# EAGLE design envelope_detection (EAGLE 9.5.1)
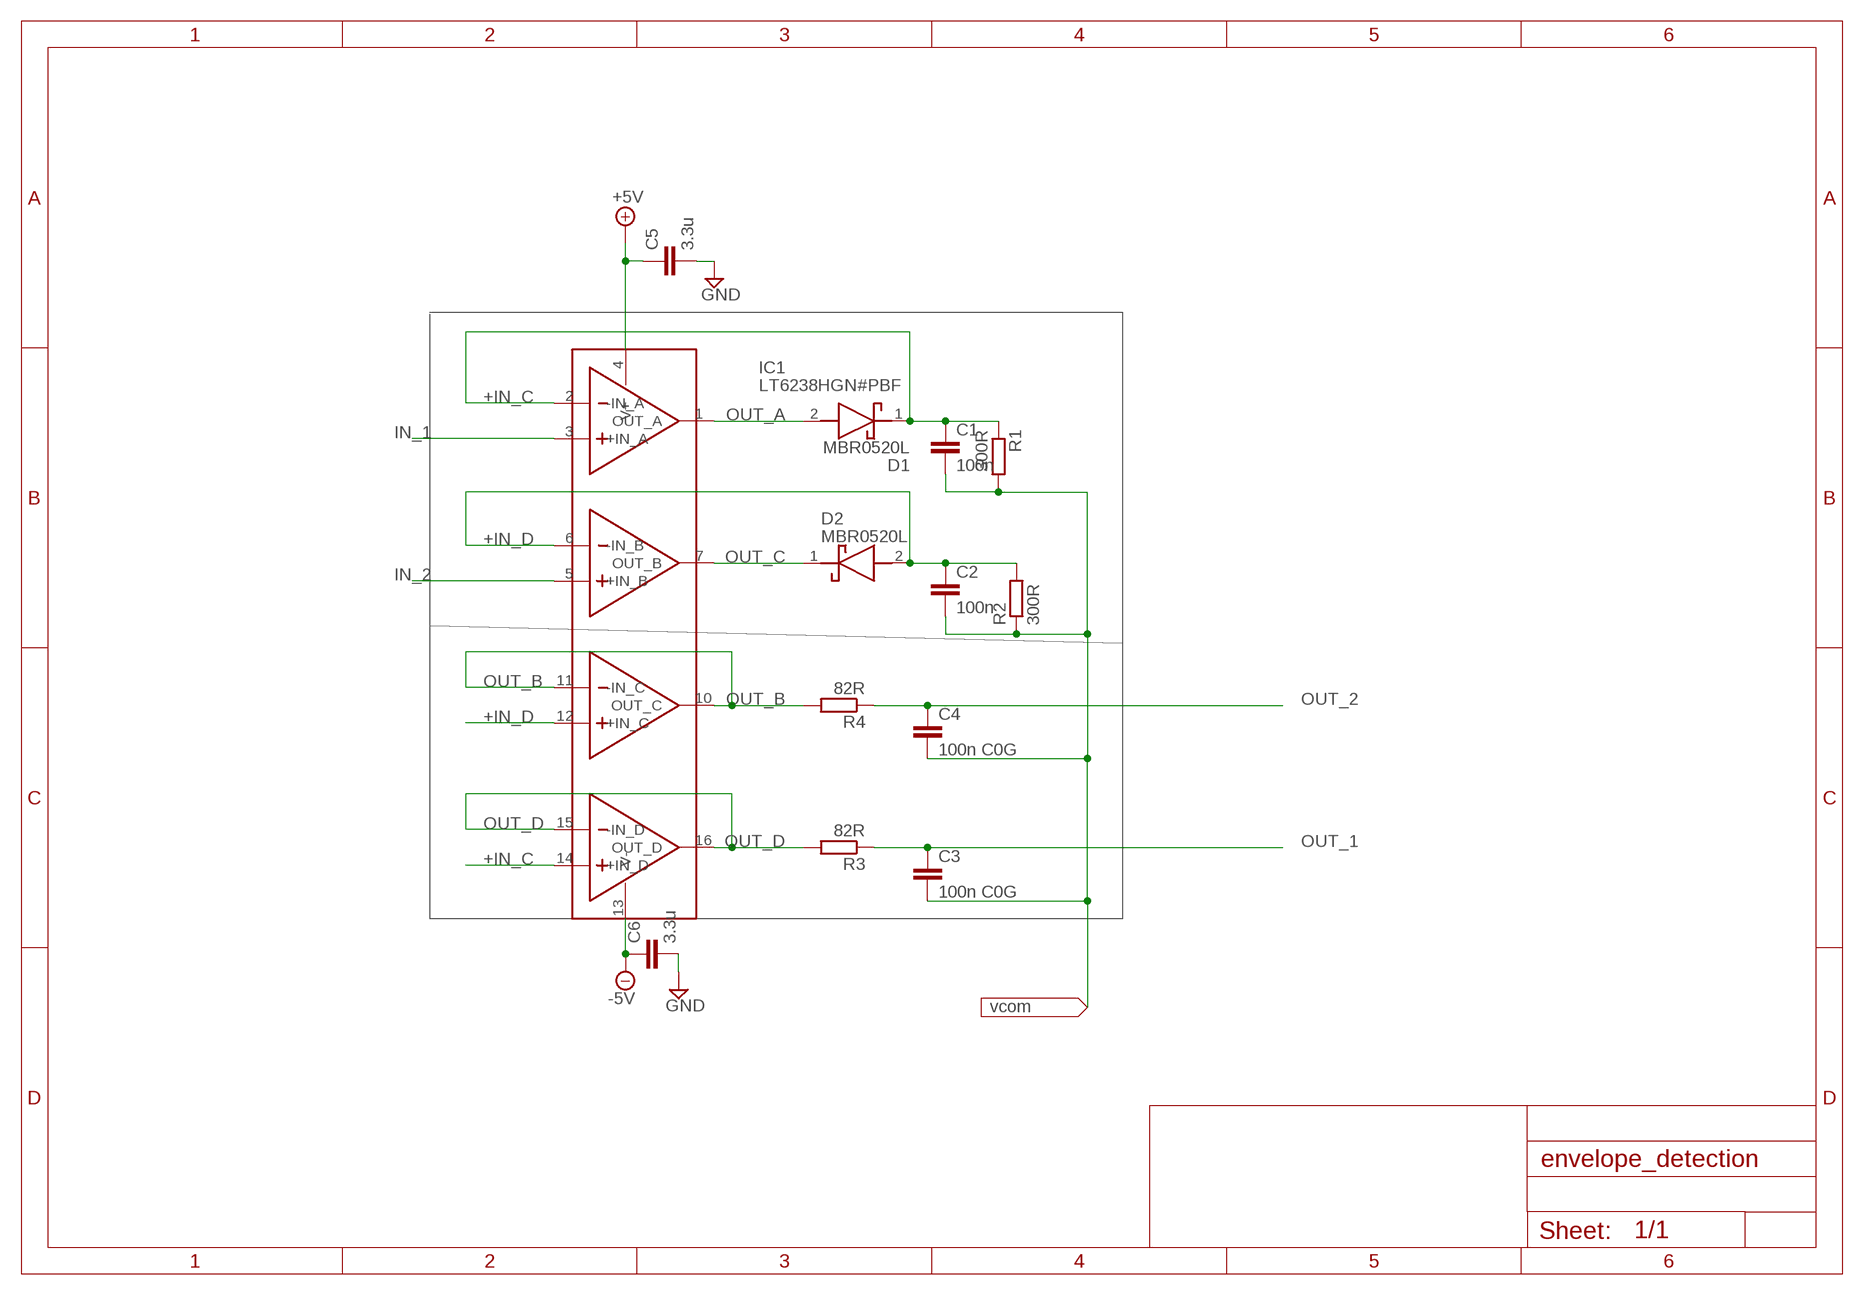
[diagram p0: schematic, sheet 1]

## Parts
C1  100n  C-EUC0603  [C0603]
C2  100n  C-EUC0603  [C0603]
C3  100n C0G  C-EUC1206  [C1206]
C4  100n C0G  C-EUC1206  [C1206]
C5  3.3u  C-EUC0402  [C0402]
C6  3.3u  C-EUC0402  [C0402]
D1  MBR0520L  [SOD3816X128N]
D2  MBR0520L  [SOD3816X128N]
IC1  LT6238HGN#PBF  [SOP64P601X175-16N]
R1  300R  R-EU_M0805  [M0805]
R2  300R  R-EU_M0805  [M0805]
R3  82R  R-EU_M0805  [M0805]
R4  82R  R-EU_M0805  [M0805]

## Nets
+5V: C5.1 IC1.4(V+)
+IN_C: C1.1 D1.1(K) IC1.2(-IN_A) IC1.14(+IN_D) R1.1
+IN_D: C2.1 D2.2(A) IC1.6(-IN_B) IC1.12(+IN_C) R2.2
-5V: C6.1 IC1.13(V-)
GND: C5.2 C6.2
IN_1: IC1.3(+IN_A)
IN_2: IC1.5(+IN_B)
OUT_1: C3.1 R3.1
OUT_2: C4.1 R4.1
OUT_A: D1.2(A) IC1.1(OUT_A)
OUT_B: IC1.10(OUT_C) IC1.11(-IN_C) R4.2
OUT_C: D2.1(K) IC1.7(OUT_B)
OUT_D: IC1.15(-IN_D) IC1.16(OUT_D) R3.2
VCOM: C1.2 C2.2 C3.2 C4.2 R1.2 R2.1

## Library data of the parts
C1-C6 = rcl:C-EU: CAPACITOR, European symbol; SPICEPREFIX: C
D1 D2 = wouter:MBR0520L: ON Semi MBR0520L SMT Schottky Diode, 20V 500mA, 2-Pin SOD-123 Source: Datasheet <https://www.onsemi.com/pub/Collateral/MBR0520L-D.pdf>; DESCRIPTION: ON Semi MBR0520L SMT Schottky Diode, 20V 500mA, 2-Pin SOD-123; HEIGHT: 1.28mm; MANUFACTURER_NAME: ON Semiconductor; MANUFACTURER_PART_NUMBER: MBR0520L; MOUSER_PART_NUMBER: 512-MBR0520L; MOUSER_PRICE-STOCK: https://www.mouser.com/Search/Refine.aspx?Keyword=512-MBR0520L; RS_PART_NUMBER: 7390521P; RS_PRICE-STOCK: http://uk.rs-online.com/web/p/products/7390521P
IC1 = wouter:LT6238HGN#PBF: Rail-to-Rail Output 215MHz, 1.1nV/Hz Op Amp/SAR ADC Driver Source: Datasheet <http://www.analog.com/media/en/technical-documentation/data-sheets/623637fb.pdf>; DESCRIPTION: Rail-to-Rail Output 215MHz, 1.1nV/Hz Op Amp/SAR ADC Driver; HEIGHT: 1.75mm; MANUFACTURER_NAME: Linear Technology; MANUFACTURER_PART_NUMBER: LT6238HGN#PBF
R1-R4 = rcl:R-EU_: RESISTOR, European symbol; SPICEPREFIX: R

## Board
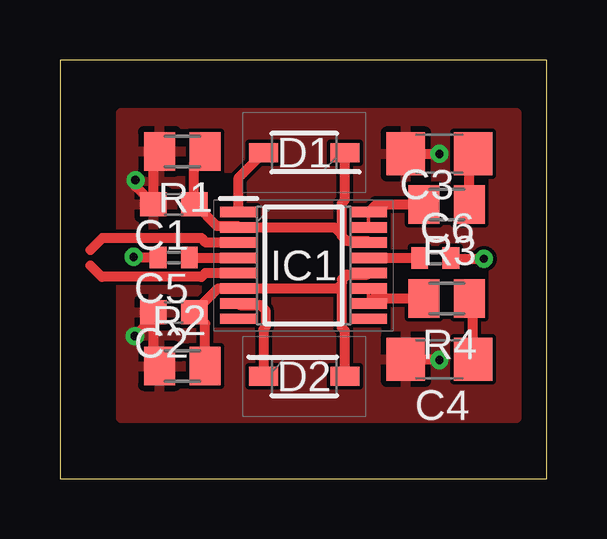
[diagram p1: board, top side]
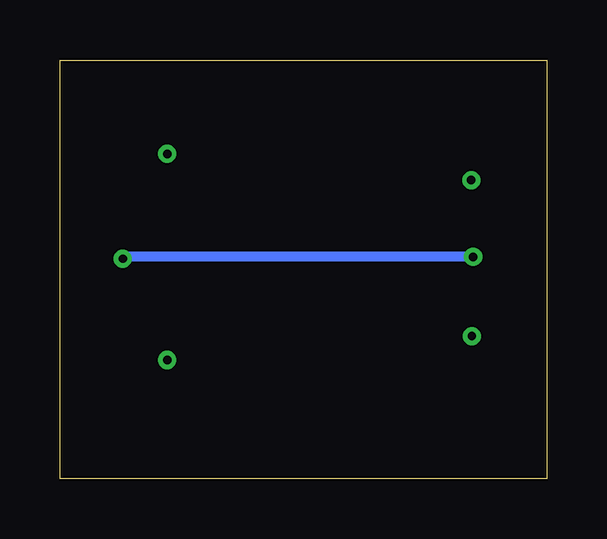
[diagram p2: board, bottom side, seen from below]

Size 20.3 x 17.45 mm. Coordinates in mm from the lower left corner, seen from the top.
Outline: 0,0 20.3,0 20.3,17.45 0,17.45 0,0
Copper layers (1*16): Top 0.035mm / dielectric 0.15mm / Bottom 0.035mm
Design rules "default": minimum track width 6mil, minimum drill 0.35mm, track to track 6mil, track to pad 6mil, pad to pad 6mil, via to via 6mil, smd to smd 6mil, copper to edge 40mil, drill to drill 6mil, minimum pad ring 10mil, minimum via ring 8mil, stop-mask expansion 4mil, vias tented up to drill 0mil, thermal gap 10mil

### Footprints (pad centres in the part's own frame; a part is rotated, then mirrored left to right if it is on the bottom)
C0603 = smd 1.1 x 1: 1 -0.85,0; 2 0.85,0
C1206 = smd 1.6 x 1.8: 1 -1.4,0; 2 1.4,0
C0402 = smd 0.7 x 0.9: 1 -0.65,0; 2 0.65,0
SOD3816X128N = smd 1.2 x 0.8: 1 -1.7,0; 2 1.7,0
SOP64P601X175-16N = smd 1.526 x 0.435: 1 -2.712,2.222; 2 -2.712,1.588; 3 -2.712,0.952; 4 -2.712,0.318; 5 -2.712,-0.318; 6 -2.712,-0.952; 7 -2.712,-1.588; 8 -2.712,-2.222; 9 2.712,-2.222; 10 2.712,-1.588; 11 2.712,-0.952; 12 2.712,-0.318; 13 2.712,0.318; 14 2.712,0.952; 15 2.712,1.588; 16 2.712,2.222
M0805 = smd 1.3 x 1.6: 1 -0.95,0; 2 0.95,0

### Placement (x,y rotation side)
C1  4.75,11.43 180 top
C2  4.75,6.93 180 top
C3  15.82,13.54 180 top
C4  15.82,4.98 180 top
C5  4.75,9.22 180 top
C6  15.65,9.19 0 top
D1  10.19,13.59 180 top
D2  10.19,4.27 0 top
IC1  10.16,8.89 0 top
R1  5.11,13.64 180 top
R2  5.11,4.7 0 top
R3  16.13,11.43 180 top
R4  16.13,7.52 180 top

### Tracks (layer width: path | path; a pad name or v marks a point on that pad's centre or on a via)
+5V
  Top 0.406: C5.1 7.44,9.22 IC1.4
+IN_C
  Top 0.152: IC1.14 12.68,10.03 12.01,10.03 | D1.1 11.88,11.43
  Top 0.406: R1.1 5.6,13.18 C1.1 5.65,11.43 6.54,10.54 7.39,10.54 IC1.2 11.44,10.48 11.75,10.17 | IC1.14 12.81,9.9 11.96,9.9 11.75,10.11 11.75,10.17 | D1.1 11.88,11.61 11.75,11.48 11.75,10.17
+IN_D
  Top 0.152: IC1.12 12.68,8.38 12.01,8.38 11.57,7.94 | 5.71,6.82 C2.1
  Top 0.406: R2.2 6.05,6.48 5.71,6.82 | C2.1 6.33,7.66 6.33,7.67 6.6,7.94 IC1.6 11.57,7.94 11.75,8.12 | 11.75,8.12 11.75,8.3 11.96,8.51 12.81,8.51 IC1.12 | D2.2 11.88,6.17 11.75,6.3 11.75,8.12
-5V
  Top 0.406: IC1.13 14.98,9.21 C6.1
GND  (via drill 0.35 pad 0.55)
  Top 0.406: C5.2 3.1,9.22 v3.07,9.25 | C6.2 16.32,9.17 v17.68,9.17
  Bottom 0.406: v3.07,9.25 17.6,9.25 v17.68,9.17
IN_1
  Top 0.406: IC1.3 6.08,9.84 5.9,10.03 1.77,10.03 1.27,9.53
IN_2
  Top 0.406: IC1.5 6.05,8.57 5.9,8.41 1.75,8.41 1.27,8.89
OUT_1
  Top 0.406: R3.1 17.08,13.39 C3.1
OUT_2
  Top 0.406: C4.1 17.22,7.37 R4.1
OUT_A
  Top 0.406: IC1.1 7.45,12.55 D1.2
OUT_B
  Top 0.152: IC1.11 IC1.10
  Top 0.406: IC1.10 13.09,7.52 R4.2
OUT_C
  Top 0.406: IC1.7 7.51,7.24 8.36,7.24 8.57,7.03 8.57,6.3 8.48,6.22 D2.1
OUT_D
  Top 0.152: IC1.16 IC1.15
  Top 0.406: IC1.16 13.19,11.43 R3.2
VCOM  (via drill 0.35 pad 0.55)
  Top 0.406: R2.1 3.9,4.96 C2.2 3.9,6.72 v3.12,5.94 | R1.2 3.9,13.38 C1.2 3.15,12.18 v3.15,12.45 | C3.2 v15.82,13.54 | C4.2 15.8,4.98 v15.82,4.95
  pour Top: 2.54,15.24 2.54,2.54 19.05,2.54 19.05,15.24